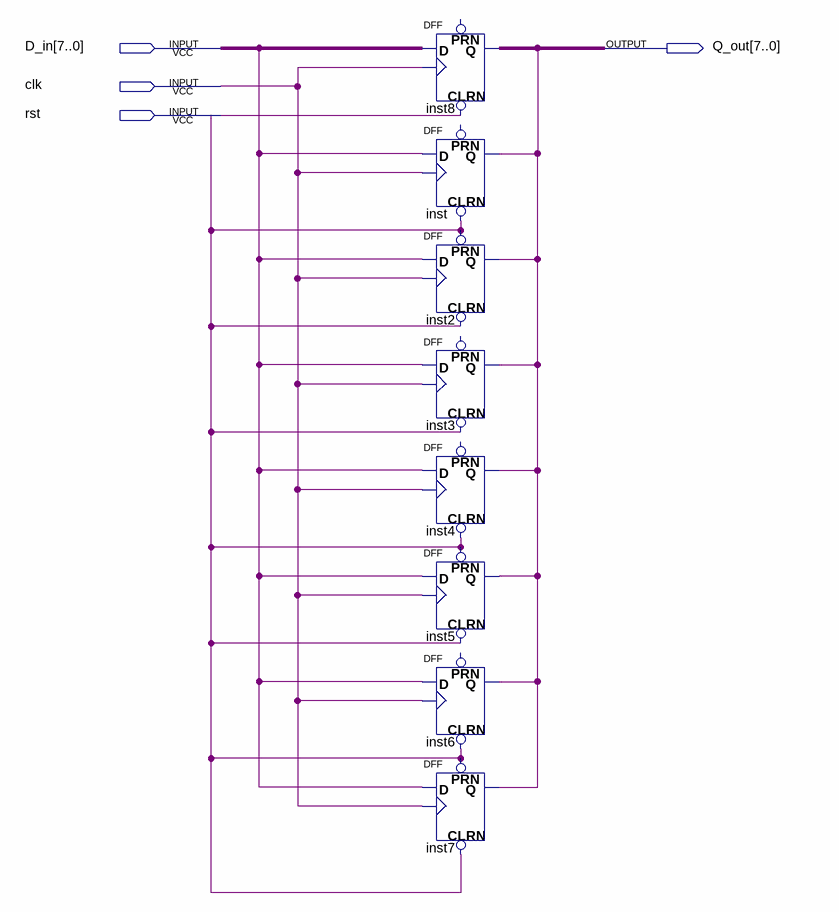
[diagram p0: schematic sheet]
// Quartus schematic reg8.bdf as structural Verilog: 8 symbols, 4 pins
module reg8 (
  input  [7:0] D_in,
  input  clk,
  input  rst,
  output [7:0] Q_out
);

  wire inst_q, undriven, undriven_2;

  DFF inst8[7:0] (.CLRN(rst), .CLK(clk), .D(D_in), .Q(Q_out));  // open: PRN
  DFF inst (.CLRN(undriven_2), .CLK(clk), .D(undriven), .Q(inst_q));  // open: PRN
  DFF inst2 (.CLRN(undriven_2), .CLK(clk), .D(undriven), .PRN(undriven_2), .Q(inst_q));
  DFF inst3 (.CLRN(undriven_2), .CLK(clk), .D(undriven), .Q(inst_q));  // open: PRN
  DFF inst4 (.CLRN(undriven_2), .CLK(clk), .D(undriven), .Q(inst_q));  // open: PRN
  DFF inst5 (.CLRN(undriven_2), .CLK(clk), .D(undriven), .PRN(undriven_2), .Q(inst_q));
  DFF inst6 (.CLRN(undriven_2), .CLK(clk), .D(undriven), .Q(inst_q));  // open: PRN
  DFF inst7 (.CLRN(undriven_2), .CLK(clk), .D(undriven), .PRN(undriven_2), .Q(inst_q));
endmodule
